# EAGLE design ECG (EAGLE 7.2.0)
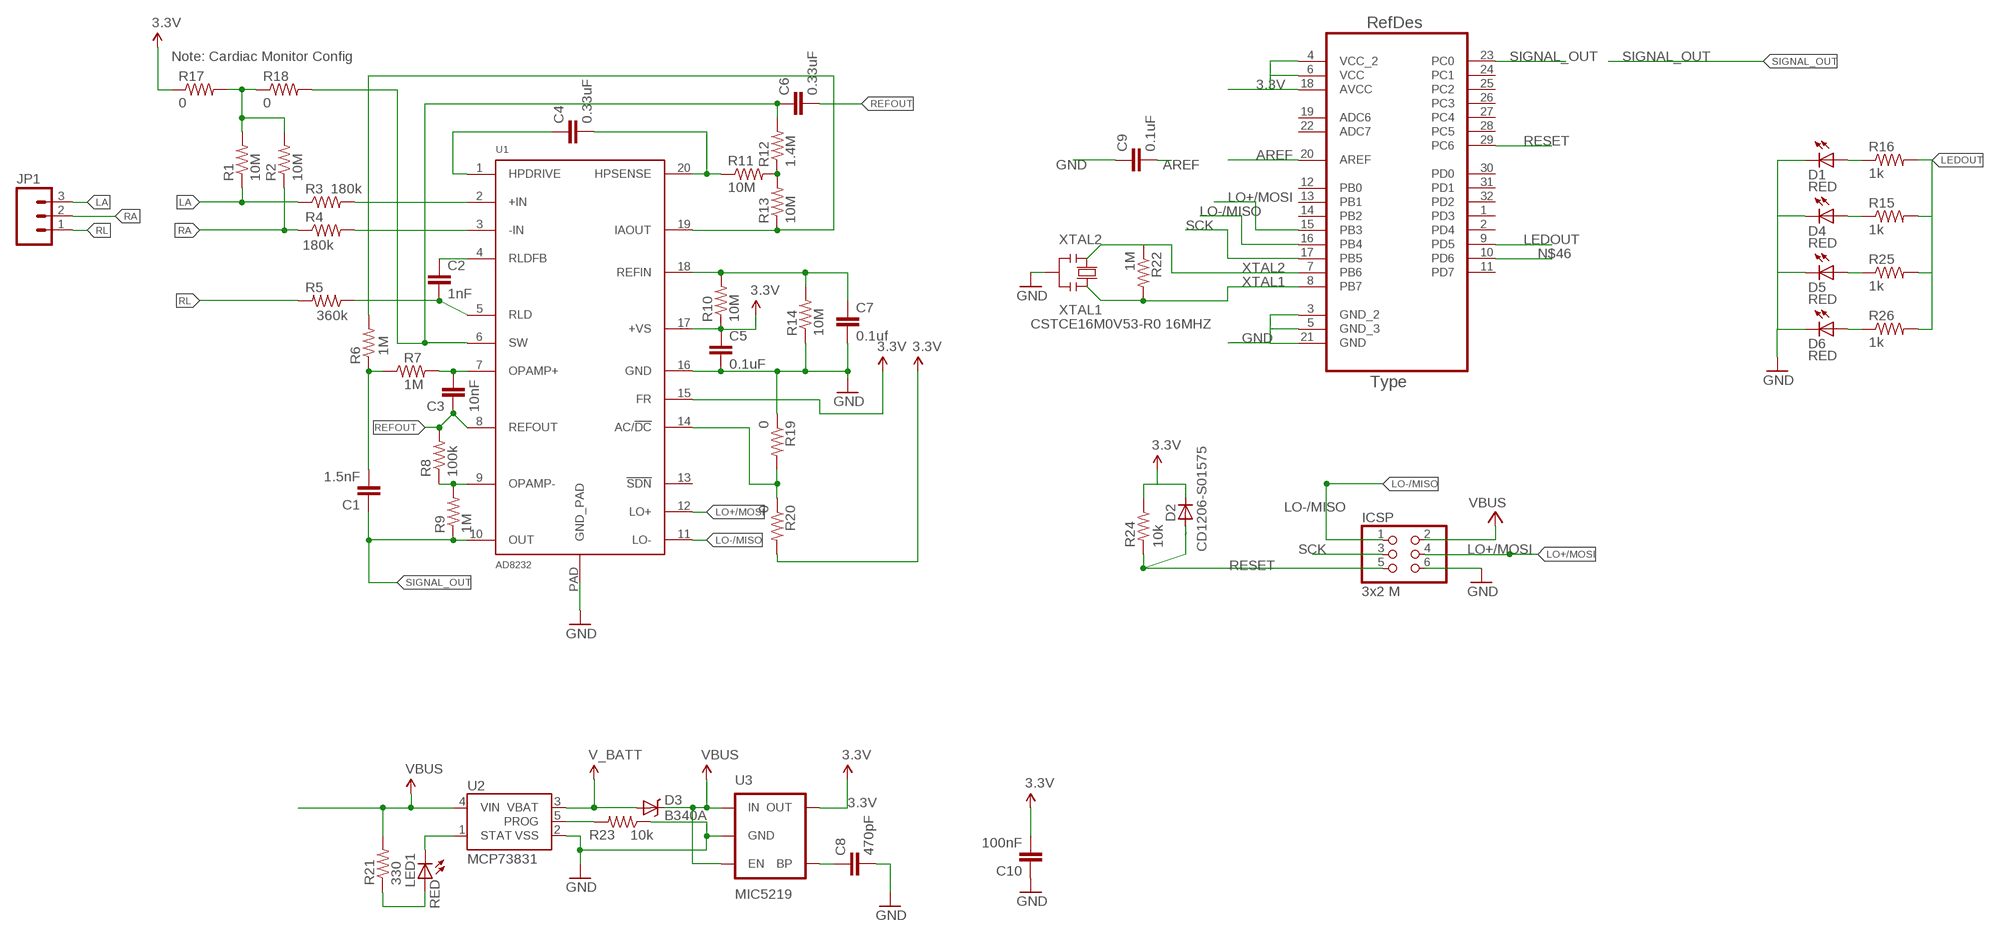
[diagram p0: schematic, sheet 1]

## Parts
C1  1.5nF  CAP0402-CAP  [0402-CAP]
C2  1nF  CAP0402-CAP  [0402-CAP]
C3  10nF  CAP0402-CAP  [0402-CAP]
C4  0.33uF  CAP0805  [0805]
C5  0.1uF  CAP0402-CAP  [0402-CAP]
C6  0.33uF  CAP0805  [0805]
C7  0.1uf  CAP0402-CAP  [0402-CAP]
C8  470pF  CAP0603-CAP  [0603-CAP]
C9  0.1uF  CAP0402-CAP  [0402-CAP]
C10  100nF  CAP0402-CAP  [0402-CAP]
D1  RED  LED-RED0603  [LED-0603@1]
D2  CD1206-S01575  DIODE-MINIMELF  [MINIMELF]
D3  B340A  DIODE-SCHOTTKY-B340A  [SMA-DIODE]
D4  RED  LED-RED0603  [LED-0603@1]
D5  RED  LED-RED0603  [LED-0603@1]
D6  RED  LED-RED0603  [LED-0603@1]
ICSP  3x2 M  PINHD-2X3  [2X03]
JP1  M03PTH  [1X03]
LED1  RED  LED0603  [LED-0603]
R1  10M  RESISTOR0402-RES  [0402-RES]
R2  10M  RESISTOR0402-RES  [0402-RES]
R3  180k  RESISTOR0402-RES  [0402-RES]
R4  180k  RESISTOR0402-RES  [0402-RES]
R5  360k  RESISTOR0402-RES  [0402-RES]
R6  1M  RESISTOR0402-RES  [0402-RES]
R7  1M  RESISTOR0402-RES  [0402-RES]
R8  100k  RESISTOR0402-RES  [0402-RES]
R9  1M  RESISTOR0402-RES  [0402-RES]
R10  10M  RESISTOR0402-RES  [0402-RES]
R11  10M  RESISTOR0402-RES  [0402-RES]
R12  1.4M  RESISTOR0402-RES  [0402-RES]
R13  10M  RESISTOR0402-RES  [0402-RES]
R14  10M  RESISTOR0402-RES  [0402-RES]
R15  1k  1K-1%  [0603-RES@1]
R16  1k  1K-1%  [0603-RES@1]
R17  0  0OHM1/10W5%(0603)  [0603]
R18  0  0OHM1/10W5%(0603)  [0603]
R19  0  0OHM1/10W5%(0603)  [0603]
R20  0  0OHM1/10W5%(0603)  [0603]
R21  330  RESISTOR0603-RES  [0603-RES]
R22  1M  RESISTOR0402-RES  [0402-RES]
R23  10k  RESISTOR0603-RES  [0603-RES]
R24  10k  RESISTOR0402-RES  [0402-RES]
R25  1k  1K-1%  [0603-RES@1]
R26  1k  1K-1%  [0603-RES@1]
U1  AD8232  [LFCSP_20]
U2  MCP73831  [SOT23-5]
U3  MIC5219  V_REG_MIC52193.3V  [SOT23-5]
U4  ATMEGA328P-AU  [QFP80P900X900X120-32N]
Y2  CSTCE16M0V53-R0 16MHZ  RESONATORMU  [RESONATOR]

## Nets
3.3V: C5.1 C10.2 D2.C R10.1 R17.1 R20.2 R24.1 U1.15(FR) U1.17(+VS) U3.5(OUT) U4.4(VCC_2) U4.6(VCC) U4.18(AVCC)
AREF: C9.2 U4.20(AREF)
GND: C5.2 C7.2 C8.2 C9.1 C10.1 D1.C D4.C D5.C D6.C ICSP.6 R14.1 R19.1 R23.1 U1.16(GND) U1.PAD(GND_PAD) U2.2(VSS) U3.2(GND) U4.3(GND_2) U4.5(GND_3) U4.21(GND) Y2.2
LA: JP1.3 R1.1 R3.1
LEDOUT: R15.2 R16.2 R25.2 R26.2 U4.9(PD5)
LO+/MOSI: ICSP.4 U1.12(LO+) U4.15(PB3)
LO-/MISO: ICSP.1 U1.11(LO-) U4.16(PB4)
N$1: R3.2 U1.2(+IN)
N$2: R4.2 U1.3(-IN)
N$3: C3.2 R7.2 U1.7(OPAMP+)
N$4: C4.2 R11.1 U1.20(HPSENSE)
N$5: C7.1 R10.2 R14.2 U1.18(REFIN)
N$6: D1.A R16.1
N$7: R8.1 R9.2 U1.9(OPAMP-)
N$8: R6.2 R13.1 U1.19(IAOUT)
N$9: C1.2 R6.1 R7.1
N$11: R19.2 R20.1 U1.14(AC/!DC)
N$13: C4.1 U1.1(HPDRIVE)
N$14: R11.2 R12.1 R13.2
N$15: LED1.A R21.1
N$16: C6.1 R12.2 R18.2 U1.6(SW)
N$17: C2.1 U1.4(RLDFB)
N$18: C2.2 R5.1 U1.5(RLD)
N$19: LED1.C U2.1(STAT)
N$20: R1.2 R2.2 R17.2 R18.1
N$21: R23.2 U2.5(PROG)
N$22: C8.1 U3.4(BP)
N$39: D6.A R26.1
N$40: D5.A R25.1
N$41: D4.A R15.1
N$46: U4.10(PD6)
RA: JP1.2 R2.1 R4.1
REFOUT: C3.1 C6.2 R8.2 U1.8(REFOUT)
RESET: D2.A ICSP.5 R24.2 U4.29(PC6)
RL: JP1.1 R5.2
SCK: ICSP.3 U4.17(PB5)
SIGNAL_OUT: C1.1 R9.1 U1.10(OUT) U4.23(PC0)
V_BATT: D3.A U2.3(VBAT)
VBUS [usbvcc]: D3.C ICSP.2 R21.2 U2.4(VIN) U3.1(IN) U3.3(EN)
XTAL1: R22.2 U4.8(PB7) Y2.3
XTAL2: R22.1 U4.7(PB6) Y2.1
Unconnected: U1.13(!SDN) U4.1(PD3) U4.2(PD4) U4.11(PD7) U4.12(PB0) U4.13(PB1) U4.14(PB2) U4.19(ADC6) U4.22(ADC7) U4.24(PC1) U4.25(PC2) U4.26(PC3) U4.27(PC4) U4.28(PC5) U4.30(PD0) U4.31(PD1) U4.32(PD2)

## Notes on the sheet
- Note: Cardiac Monitor Config

## Library data of the parts
C1-C7 C9 C10 = SparkFun-Passives:CAP: Capacitor Standard 0603 ceramic capacitor, and 0.1" leaded capacitor.
C8 = SparkFun-Passives:CAP: Capacitor Standard 0603 ceramic capacitor, and 0.1" leaded capacitor.; PROD_ID: CAP-07884
D1 D4-D6 = SparkFun-LED:LED-RED: Assorted Red LEDs LilyPad 1206- DIO-09912 1206- DIO-00809 0603- DIO-00819; PROD_ID: DIO-00819
D2 = diode:DIODE-: DIODE
D3 = SparkFun-DiscreteSemi:DIODE-SCHOTTKY: Schottky diodes in SFE's production catalog BAT20J 1A 23V 0.62Vf RB751 120mA 40V 0.37Vf PMEG4005EJ 0.5A 40V 0.42Vf MBRA140 1A 40V 0.5Vf B340A 3A 40V SMA; PROD_ID: DIO-09886
ICSP = SmartPrj:PINHD-2X3: PIN HEADER
JP1 = SparkFun-Connectors:M03: Header 3 Standard 3-pin 0.1" header. Use with straight break away headers (SKU : PRT-00116), right angle break away headers (PRT-00553), swiss pins (PRT-00743), machine pins (PRT-00117), and female headers (PRT-00115). Molex polarized connector foot print use with SKU : PRT-08232 with associated crimp pins and housings.
LED1 = SparkFun-LED:LED: LEDs Standard schematic elements and footprints for 5mm, 3mm, 1206, and 0603 sized LEDs. 5mm - Spark Fun Electronics SKU : COM-00529 (and others); PROD_ID: DIO-00819
R1-R14 R22 R24 = SparkFun-Passives:RESISTOR: Resistor Basic schematic elements and footprints for 0603, 1206, and PTH resistors.
R15 R16 R25 R26 = SparkFun-Resistors:1K-1%: 1k-ohm SMT 1/10W - 1% (0603) RES-07856; PROD_ID: RES-07856
R17-R20 = SparkFun-Resistors:0OHM1/10W5%(0603): RES-08609; PROD_ID: RES-08609
R21 = SparkFun-Passives:RESISTOR: Resistor Basic schematic elements and footprints for 0603, 1206, and PTH resistors.; PROD_ID: RES-00818
R23 = SparkFun-Resistors:RESISTOR: Resistor Basic schematic elements and footprints for 0603, 1206, and PTH resistors.; PROD_ID: RES-00824
U1 = AD8232:AD8232
U2 = SparkFun-PowerIC:MCP73831: Miniature single cell, fully integrated Li-Ion, Li-polymer charge management controller http://ww1.microchip.com/downloads/en/DeviceDoc/21984a.pdf IC-09995; PROD_ID: IC-09995
U3 = SparkFun-PowerIC:V_REG_MIC5219: V_REG MIC5219 Standard 3.3V and 5V 500mA LDO voltage regulator in SOT-23 layout. Micrel part MIC5219. BP (by-pass) pin is used to lower output noise with 470pF cap, may be left open.; PROD_ID: VREG-09872; VALUE: MIC5219 3.3V
U4 = atmega328tqfp:ATMEGA328P-AU; DESCRIPTION: 8-bit Microcontroller with In-System Programmable Flash; MPN: ATMEGA328P-AU; OC_FARNELL: 1715486; OC_NEWARK: 14R4631; PACKAGE: TQFP-32; SUPPLIER: Atmel
Y2 = SmartPrj:RESONATOR

## Net classes
0 default: clearance 0.205 mm
2 gnd: width 0.305 mm, drill 0.559 mm, clearance 0.254 mm
3 usbvcc: width 0.508 mm, drill 0.61 mm, clearance 0.205 mm to class 0, clearance 0.205 mm to class 1, clearance 0.205 mm to class 2, clearance 0.254 mm
4 aref: width 0.406 mm, drill 0.61 mm, clearance 0.254 mm

## Board
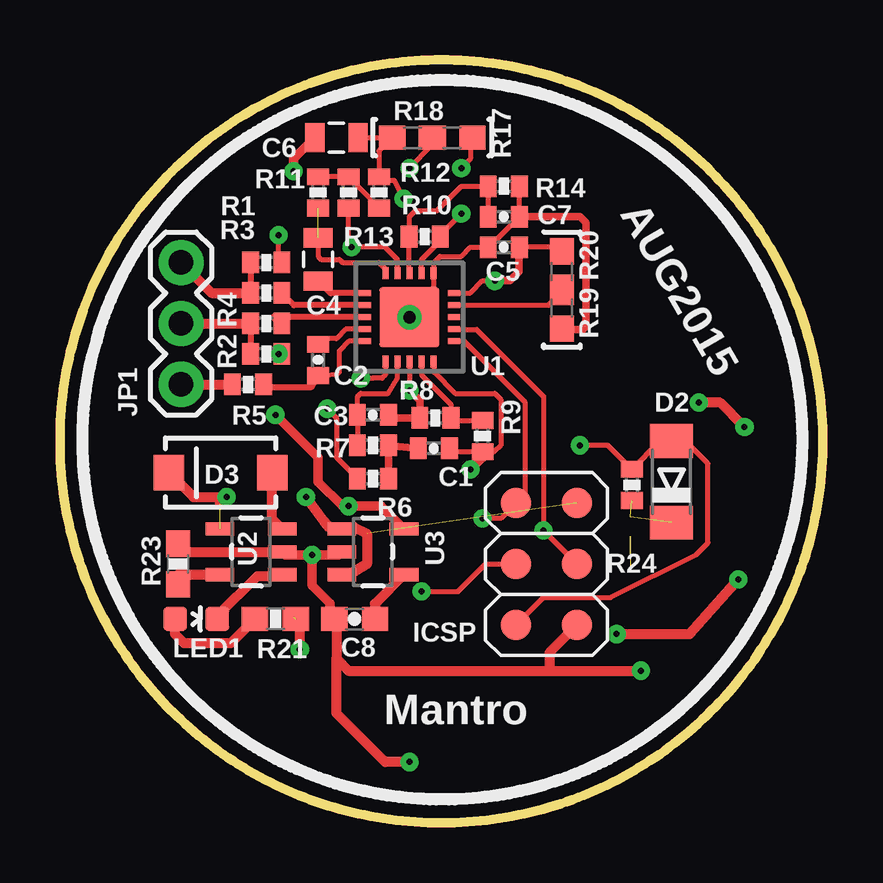
[diagram p1: board, top side]
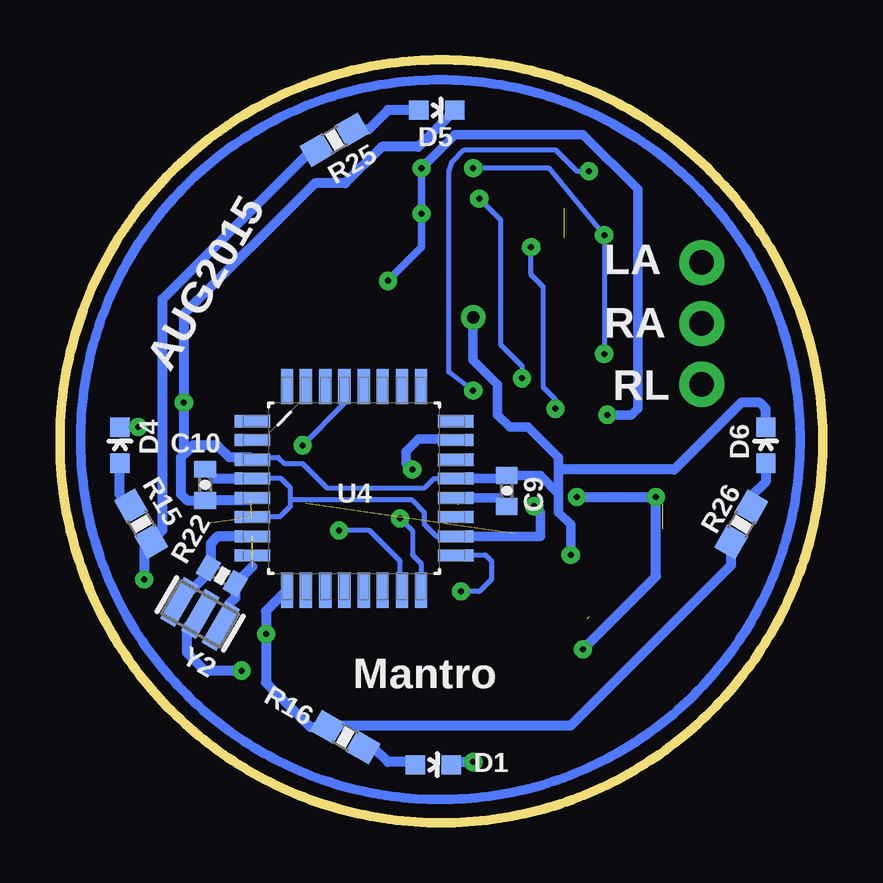
[diagram p2: board, bottom side, seen from below]

Size 31.8 x 31.8 mm. Coordinates in mm from the lower left corner, seen from the top.
Outline: 31.8,15.63 31.79,15.35 31.78,15.08 31.77,14.81 31.75,14.54 31.72,14.27 31.69,14.01 31.66,13.74 31.62,13.48 31.58,13.22 31.53,12.95 31.48,12.7 31.42,12.44 31.37,12.18 31.3,11.93 31.23,11.67 31.16,11.42 31.09,11.17 31.01,10.92 30.92,10.68 30.84,10.43 30.75,10.19 30.65,9.95 30.55,9.71 30.45,9.47 30.34,9.24 30.23,9.01 30.12,8.78 30,8.55 29.88,8.32 29.76,8.1 29.63,7.87 29.5,7.66 29.37,7.44 29.23,7.22 29.09,7.01 28.94,6.8 28.79,6.59 28.64,6.39 28.49,6.18 28.33,5.98 28.17,5.79 28.01,5.59 27.84,5.4 27.67,5.21 27.5,5.02 27.32,4.84 27.14,4.66 26.96,4.48 26.78,4.3 26.59,4.13 26.4,3.96 26.21,3.79 26.01,3.63 25.82,3.47 25.62,3.31 25.41,3.16 25.21,3.01 25,2.86 24.79,2.72 24.58,2.57 24.36,2.43 24.14,2.3 23.93,2.17 23.7,2.04 23.25,1.8 23.03,1.68 22.79,1.57 22.56,1.46 22.33,1.35 21.85,1.15 21.61,1.05 21.37,0.96 21.12,0.88 20.88,0.79 20.38,0.64 20.13,0.57 19.87,0.5 19.62,0.44 19.36,0.38 19.1,0.32 18.85,0.27 18.58,0.22 18.32,0.18 18.06,0.14 17.79,0.11 17.53,0.08 17.26,0.05 16.99,0.03 16.72,0.02 16.45,0.01 16.17,0 15.63,0 15.35,0.01 15.08,0.02 14.81,0.03 14.54,0.05 14.27,0.08 14.01,0.11 13.74,0.14 13.48,0.18 13.22,0.22 12.95,0.27 12.7,0.32 12.44,0.38 12.18,0.44 11.93,0.5 11.67,0.57 11.42,0.64 11.17,0.71 10.92,0.79 10.68,0.88 10.43,0.96 10.19,1.05 9.95,1.15 9.47,1.35 9.24,1.46 9.01,1.57 8.78,1.68 8.55,1.8 8.1,2.04 7.87,2.17 7.66,2.3 7.44,2.43 7.22,2.57 7.01,2.72 6.8,2.86 6.59,3.01 6.39,3.16 6.18,3.31 5.98,3.47 5.79,3.63 5.59,3.79 5.4,3.96 5.21,4.13 5.02,4.3 4.84,4.48 4.48,4.84 4.3,5.02 4.13,5.21 3.96,5.4 3.79,5.59 3.63,5.79 3.47,5.98 3.31,6.18 3.16,6.39 3.01,6.59 2.86,6.8 2.72,7.01 2.57,7.22 2.44,7.44 2.3,7.66 2.17,7.87 2.04,8.1 1.92,8.32 1.8,8.55 1.68,8.78 1.57,9.01 1.46,9.24 1.35,9.47 1.15,9.95 1.05,10.19 0.97,10.43 0.88,10.68 0.79,10.92 0.72,11.17 0.64,11.42 0.57,11.67 0.5,11.93 0.44,12.18 0.38,12.44 0.32,12.7 0.27,12.95 0.22,13.22 0.18,13.48 0.14,13.74 0.11,14.01 0.08,14.27 0.06,14.54 0.03,14.81 0.02,15.08 0.01,15.35 0,15.63 0,16.17 0.01,16.45 0.02,16.72 0.03,16.99 0.06,17.26 0.08,17.53 0.11,17.79 0.14,18.06 0.18,18.32 0.22,18.58 0.27,18.85 0.32,19.1 0.38,19.36 0.44,19.62 0.5,19.87 0.57,20.13 0.64,20.38 0.72,20.63 0.79,20.88 0.88,21.12 0.97,21.37 1.05,21.61 1.15,21.85 1.35,22.33 1.46,22.56 1.57,22.79 1.68,23.03 1.8,23.25 1.92,23.48 2.04,23.7 2.17,23.93 2.3,24.14 2.44,24.36 2.57,24.58 2.72,24.79 2.86,25 3.01,25.21 3.16,25.41 3.31,25.62 3.47,25.82 3.63,26.01 3.79,26.21 3.96,26.4 4.13,26.59 4.3,26.78 4.48,26.96 4.66,27.14 4.84,27.32 5.02,27.5 5.21,27.67 5.4,27.84 5.59,28.01 5.79,28.17 5.98,28.33 6.18,28.49 6.39,28.64 6.59,28.79 6.8,28.94 7.01,29.08 7.22,29.23 7.44,29.37 7.66,29.5 7.87,29.63 8.1,29.76 8.32,29.88 8.55,30 8.78,30.12 9.01,30.23 9.24,30.34 9.47,30.45 9.95,30.65 10.19,30.75 10.43,30.84 10.68,30.92 10.92,31.01 11.17,31.09 11.42,31.16 11.67,31.23 11.93,31.3 12.18,31.36 12.44,31.42 12.7,31.48 12.95,31.53 13.22,31.58 13.48,31.62 13.74,31.66 14.01,31.69 14.27,31.72 14.54,31.75 14.81,31.77 15.08,31.78 15.35,31.79 15.63,31.8 16.17,31.8 16.45,31.79 16.72,31.78 16.99,31.77 17.26,31.75 17.53,31.72 17.79,31.69 18.06,31.66 18.32,31.62 18.58,31.58 18.85,31.53 19.1,31.48 19.36,31.42 19.62,31.36 19.87,31.3 20.13,31.23 20.38,31.16 20.63,31.09 20.88,31.01 21.12,30.92 21.37,30.84 21.61,30.75 21.85,30.65 22.33,30.45 22.56,30.34 22.79,30.23 23.03,30.12 23.25,30 23.48,29.88 23.7,29.76 23.93,29.63 24.14,29.5 24.36,29.37 24.58,29.23 24.79,29.08 25,28.94 25.21,28.79 25.41,28.64 25.62,28.49 25.82,28.33 26.01,28.17 26.21,28.01 26.4,27.84 26.59,27.67 26.78,27.5 26.96,27.32 27.14,27.14 27.32,26.96 27.5,26.78 27.67,26.59 27.84,26.4 28.01,26.21 28.17,26.01 28.33,25.82 28.49,25.62 28.64,25.41 28.79,25.21 28.94,25 29.09,24.79 29.23,24.58 29.37,24.36 29.5,24.14 29.63,23.93 29.76,23.7 29.88,23.48 30,23.25 30.12,23.03 30.23,22.79 30.34,22.56 30.45,22.33 30.55,22.09 30.65,21.85 30.75,21.61 30.84,21.37 30.92,21.12 31.01,20.88 31.09,20.63 31.16,20.38 31.23,20.13 31.3,19.87 31.37,19.62 31.42,19.36 31.48,19.1 31.53,18.85 31.58,18.58 31.62,18.32 31.66,18.06 31.69,17.79 31.72,17.53 31.75,17.26 31.77,16.99 31.78,16.72 31.79,16.45 31.8,16.17 31.8,15.63
Copper layers (1*16): Top 0.035mm / dielectric 0.8mm / Bottom 0.035mm
Design rules "integrated": minimum track width 10mil, minimum drill 10mil, track to track 0.205mm, track to pad 0.205mm, pad to pad 0.205mm, via to via 0.205mm, smd to smd 8mil, copper to edge 8mil, drill to drill 8mil, minimum pad ring 10mil, minimum via ring 10mil, stop-mask expansion 4mil, vias tented up to drill 20mil, thermal gap 15mil

### Footprints (pad centres in the part's own frame; a part is rotated, then mirrored left to right if it is on the bottom)
0402-CAP = smd 0.7 x 0.9: 1 -0.65,0; 2 0.65,0
0805 = smd 0.8 x 1.2: 1 -0.9,0; 2 0.9,0
0603-CAP = smd 1.1 x 1: 1 -0.85,0; 2 0.85,0
LED-0603@1 = smd 0.8 x 0.8: A 0,-0.75; C 0,0.75
MINIMELF = smd 1.4 x 1.8: A 1.7,0; C -1.7,0
SMA-DIODE = smd 1.27 x 1.47: A -2.15,0; C 2.15,0
2X03 = smd 1.27 x 1.27: 1 -2.54,-1.27; 2 -2.54,1.27; 3 0,-1.27; 4 0,1.27; 5 2.54,-1.27; 6 2.54,1.27
1X03 = drill 1.016 pad 1.88: 1 0,0; 2 2.54,0; 3 5.08,0
LED-0603 = smd 1 x 1: A 0,-0.877; C 0,0.877
0402-RES = smd 0.7 x 0.9: 1 -0.65,0; 2 0.65,0
0603-RES@1 = smd 1.1 x 1: 1 -0.85,0; 2 0.85,0
0603 = smd 1.1 x 1: 1 -0.85,0; 2 0.85,0
0603-RES = smd 1.1 x 1: 1 -0.85,0; 2 0.85,0
LFCSP_20 = smd 0.5 x 0.25: 1 -1.85,1; 2 -1.85,0.5; 3 -1.85,0; 4 -1.85,-0.5; 5 -1.85,-1; 11 1.85,-1; 12 1.85,-0.5; 13 1.85,0; 14 1.85,0.5; 15 1.85,1 | smd 0.25 x 0.5: 6 -1,-1.85; 7 -0.5,-1.85; 8 0,-1.85; 9 0.5,-1.85; 10 1,-1.85; 16 1,1.85; 17 0.5,1.85; 18 0,1.85; 19 -0.5,1.85; 20 -1,1.85 | smd 2.5 x 2.5: PAD 0,0
SOT23-5 = smd 0.55 x 1.2: 1 -0.95,-1.3; 2 0,-1.3; 3 0.95,-1.3; 4 0.95,1.3; 5 -0.95,1.3
QFP80P900X900X120-32N = smd 1.473 x 0.508: 1 -4.242,2.794; 2 -4.242,2.007; 3 -4.242,1.194; 4 -4.242,0.406; 5 -4.242,-0.406; 6 -4.242,-1.194; 7 -4.242,-2.007; 8 -4.242,-2.794; 17 4.242,-2.794; 18 4.242,-2.007; 19 4.242,-1.194; 20 4.242,-0.406; 21 4.242,0.406; 22 4.242,1.194; 23 4.242,2.007; 24 4.242,2.794 | smd 0.508 x 1.473: 9 -2.794,-4.242; 10 -2.007,-4.242; 11 -1.194,-4.242; 12 -0.406,-4.242; 13 0.406,-4.242; 14 1.194,-4.242; 15 2.007,-4.242; 16 2.794,-4.242; 25 2.794,4.242; 26 2.007,4.242; 27 1.194,4.242; 28 0.406,4.242; 29 -0.406,4.242; 30 -1.194,4.242; 31 -2.007,4.242; 32 -2.794,4.242
RESONATOR = smd 0.7 x 2: 1 -1,0; 2 0,0; 3 1,0

### Placement (x,y rotation side)
C1  15.59,15.61 180 top
C2  10.76,19.29 270 top
C3  13.05,17.01 180 top
C4  10.76,23.48 90 top
C5  18.51,23.99 180 top
C6  11.52,28.56 180 top
C7  18.51,25.26 0 top
C8  12.29,8.5 180 top
C9  13.17,13.83 270 bottom
C10  25.75,14.09 90 bottom
D1  16.24,2.42 270 bottom
D2  25.49,14.21 90 top
D3  6.7,14.59 180 top
D4  29.3,15.74 0 bottom
D5  16.1,29.71 270 bottom
D6  2.38,15.74 0 bottom
DRILEGEND  [DRILEGEND]  0.69,-144.01 0 top  (outside the outline)
ICSP  20.29,10.78 270 top
JP1  5.05,18.28 90 top
LED1  5.68,8.5 270 top
R1  8.6,23.36 0 top
R2  8.6,19.55 0 top
R3  8.6,22.09 0 top
R4  8.6,20.82 0 top
R5  7.84,18.28 180 top
R6  13.05,14.34 180 top
R7  13.05,15.74 180 top
R8  15.65,16.88 180 top
R9  17.62,16.12 90 top
R10  15.21,24.44 180 top
R11  10.76,26.28 90 top
R12  13.3,26.28 90 top
R13  12.03,26.28 90 top
R14  18.51,26.53 180 top
R15  28.41,12.47 300 bottom
R16  19.91,3.57 150 bottom
R17  16.35,28.56 180 top
R18  14.7,28.56 180 top
R19  20.92,21.45 90 top
R20  20.92,22.98 90 top
R21  8.98,8.5 0 top
R22  25.05,10.29 150 bottom
R23  4.92,10.78 270 top
R24  23.84,14.09 90 top
R25  20.35,28.47 210 bottom
R26  3.4,12.44 240 bottom
U1  14.57,21.07 0 top
U2  7.97,11.29 90 top
U3  13.05,11.29 270 top
U4  19.54,13.94 0 bottom
Y2  25.95,8.71 150 bottom

### Tracks (layer width: path | path; a pad name or v marks a point on that pad's centre or on a via)
3.3V  (via drill 0.25)  (2 unrouted)
  Top 0.2: v16.73,25.39 15.98,24.64 R10.1 15.86,24.26 15.08,23.48 U1.17 | R20.2 20.76,23.99 C5.1 | U1.15 16.44,22.09 17.11,22.09 17.62,22.6 v18.13,22.6 | R17.1 17.11,28.48 17.11,27.68 v16.73,27.29
  Top 0.305: C5.1 19.14,23.98 19.14,22.98 18.76,22.6 v18.13,22.6
  Top 0.4: U3.5 13.39,13.2 v12.03,13.2 11.78,13.2 10.76,14.21 10.76,15.23 v8.98,17.01
  Bottom 0.2: 23.66,14.47 U4.4 22.58,14.35 22.19,13.96 22.19,13.45 | U4.6 22.64,12.75 22.19,13.2 22.19,13.45 | U4.18 15.31,11.93 16.1,11.93 16.6,12.44 16.6,12.94 17.11,13.45 22.19,13.45
  Bottom 0.305: v16.73,27.29 v16.73,25.39 16.73,23.99 v18.13,22.6
  Bottom 0.4: v12.03,13.2 11.78,12.94 11.78,11.93 11.79,11.94 U4.18 | v16.73,27.29 15.33,28.69 10,28.69 7.71,26.41 7.71,17.26 7.97,17.01 v8.98,17.01
  Bottom 0.406: C10.2 25.36,14.35 U4.4
AREF
  Bottom 0.4: 15.21,13.45 U4.20 13.53,13.54 C9.2
GND  (via drill 0.25, 0.51)
  Top 0.2: R14.1 C7.2 17.89,23.99 C5.2 17.11,23.99 16.73,23.61 15.84,23.61 15.59,23.36 15.59,22.94 U1.16
  Top 0.203: 15.07,21.57 U1.PAD 15.57,22.33 U1.16
  Top 0.305: R19.1 20.96,20.56 21.81,20.56 21.94,20.69 21.94,25.01 21.68,25.26 C7.2
  Top 0.4: C8.2 11.27,8.66 11.27,9.13 10.51,9.9 v10.51,11.17 | U2.2 9.39,11.17 v10.51,11.17 | U3.2 11.62,11.17 v10.51,11.17
  Top 0.406: R23.1 5.26,11.29 U2.2 | C8.2 11.52,8.41 11.52,6.85 | 11.52,6.85 12.03,6.34 20.41,6.34 | 20.41,6.34 v24.22,6.34 | ICSP.6 20.41,7.1 20.41,6.34 | v14.57,2.53 13.56,2.53 11.52,4.56 11.52,6.85 | v28.54,16.5 27.53,17.52 v26.64,17.52
  Bottom 0.2: U4.5 23.87,13.45 | 23.87,15.23 22.7,15.23 22.45,14.98 21.68,14.98 20.67,13.96 16.6,13.96 16.21,14.35 U4.21
  Bottom 0.4: U4.21 13.31,14.35 C9.1 13.16,14.47 11.78,14.47 11.02,13.71 | v10.51,11.17 10.51,12.44 11.02,12.94 11.02,13.71 | 11.02,13.71 11.02,14.72 11.02,15.23 12.29,16.5 13.05,16.5 13.56,17.01 13.56,18.28 14.57,19.29 U1.PAD
  Bottom 0.406: 23.87,13.45 23.88,13.44 C10.1 26.49,13.44 26.76,13.71 26.76,15.23 26.64,15.36 | U4.3 23.87,15.23 24.73,15.23 25.24,15.74 26.26,15.74 26.64,15.36 | v24.22,6.34 25.75,6.34 26.51,7.1 26.51,8.15 Y2.2 | D1.C 15.38,2.53 v14.57,2.53 | D6.C 2.38,17.26 2.63,17.52 3.4,17.52 6.19,14.72 11.02,14.72 | D5.C 15.59,29.47 16.1,28.95 16.86,28.18 18.38,28.18 19.91,26.66 21.18,26.66 26.64,21.2 v26.64,17.52 26.64,15.36 | D4.C v28.54,16.5
  other vias: 14.57,21.07
LA
  Top 0.254: R1.1 R3.1
  Top 0.406: JP1.3 6.32,22.09 R3.1
LEDOUT  (via drill 0.25)
  Top 0.406: v23.21,7.86 26.26,7.86 v28.29,10.15
  Bottom 0.406: U4.9 23.21,8.83 v23.21,7.86 23.21,5.83 21.37,3.99 R16.2 20.58,4.05 10.51,4.05 3.82,10.74 R26.2 | R25.2 21.31,28.05 27.53,21.83 27.53,12.2 R15.2 28.29,11.44 v28.29,10.15
LO+/MOSI  (via drill 0.25)
  Top 0.2: ICSP.4 v20.16,12.18 20.16,17.77 17.37,20.56 U1.12
  Bottom 0.2: U4.15 17.62,9.79 17.62,10.91 18.89,12.18 v20.16,12.18
LO-/MISO  (via drill 0.25)
  Top 0.2: 18,18.91 19.4,17.52 19.4,13.71 ICSP.1 18.38,12.69 v17.62,12.69
  Top 0.203: U1.11 16.84,20.07 18,18.91
  Bottom 0.2: v17.62,12.69 17.11,12.18 17.11,11.17 16.75,10.8 U4.16
N$1
  Top 0.254: U1.2 9.75,21.57 9.24,22.09 R3.2
N$2
  Top 0.254: U1.3 8.86,21.07 R4.2
N$3
  Top 0.2: U1.7 14.07,18.54 13.68,17.9 12.54,17.9 12.41,17.77 12.41,17.02 C3.2 R7.2
N$4  (1 unrouted)
  Top 0.2: C4.2 10.76,23.61 10.89,23.48 11.65,23.48 11.78,23.36 13.3,23.36 13.56,23.1 13.56,22.94 U1.20
N$5
  Top 0.2: C7.1 R14.2 16.73,26.53 15.71,25.52 14.83,25.52 14.57,25.26 14.57,24.5 14.44,24.37 14.49,24.37 R10.2 | R10.2 14.57,24.45 | U1.18 14.56,22.94 R10.2
N$6
  Bottom 0.406: D1.A 17.1,2.53 18.13,2.53 18.74,3.14 R16.1
N$7
  Top 0.2: U1.9 15.08,18.66 16.3,17.44 R8.1 16.44,16.77 R9.2
N$8  (via drill 0.25)
  Top 0.2: R13.1 12.03,24.12 v12.16,23.99 13.56,23.99 14.06,23.48 U1.19 | v11.14,17.26 11.52,16.88 11.52,15.23 12.4,14.36 R6.2
  Bottom 0.2: v11.14,17.26 11.14,17.64 11.65,18.15 11.65,22.34 12.16,22.85 v12.16,23.99
N$9
  Top 0.305: R6.1 R7.1 C1.2 15.06,15.61
N$11
  Top 0.203: U1.14 17.37,21.57 19.14,21.58 20.37,21.58 R20.1 R19.2
N$12  (via drill 0.25)
  other vias: 10,7.23
N$13
  Top 0.254: U1.1 11.29,22.07 C4.1
N$14
  Top 0.2: R12.1 R13.2 R11.2
N$15
  Top 0.406: R21.1 7.12,7.48 5.17,7.48 4.8,7.85 LED1.A
N$16  (via drill 0.25)
  Top 0.2: C6.1 R18.2 13.3,28.02 R12.2 13.3,26.79 13.94,26.79 v14.32,26.02 | v12.54,18.53 13.04,18.53
  Top 0.203: U1.6 13.57,18.67 13.43,18.53 13.04,18.53
  Bottom 0.2: v14.32,26.02 13.43,25.14 13.43,19.93 12.54,19.04 v12.54,18.53
N$17
  Top 0.203: U1.4 11.91,20.57 11.52,20.18 10.76,20.18 C2.1
N$18
  Top 0.203: C2.2 11.56,18.7 11.65,18.79 11.65,19.67 12.05,20.07 U1.5 | R5.1 8.6,18.15
  Top 0.254: C2.2 10.47,18.15 8.6,18.15
N$19
  Top 0.406: U2.1 9.27,10.28 8.22,10.28 6.56,8.61 LED1.C
N$20  (via drill 0.25)
  Top 0.2: R2.2 8.74,19.8 v9.11,19.55 | R1.2 9.11,23.47 v9.11,24.5 | v14.57,27.29 15.5,28.22 R17.2
  Top 0.203: R17.2 R18.1
  Bottom 0.2: v9.11,19.55 v9.11,24.5 11.4,27.29 v14.57,27.29
N$21
  Top 0.406: R23.2 4.92,10.34 U2.5
N$22
  Top 0.406: U3.4 13.14,9.13 C8.1
N$33  (via drill 0.25)
  other vias: 14.57,27.29
N$39
  Bottom 0.406: D6.A 2.38,14.21 2.97,13.62 R26.1
N$40
  Bottom 0.406: D5.A 18.13,29.71 18.94,28.9 R25.1
N$41
  Bottom 0.406: R15.1 29.3,13.67 D4.A
N$42
  Top 0.4: 30.94,15.71 30.93,15.45 30.92,15.2 30.91,14.94 30.89,14.69 30.84,14.18 30.81,13.93 30.77,13.69 30.73,13.44 30.69,13.19 30.64,12.95 30.59,12.7 30.53,12.46 30.47,12.22 30.41,11.98 30.34,11.74 30.27,11.51 30.19,11.27 30.11,11.04 30.03,10.81 29.95,10.58 29.86,10.36 29.76,10.13 29.67,9.91 29.57,9.68 29.46,9.47 29.36,9.25 29.25,9.03 29.13,8.82 29.01,8.61 28.89,8.4 28.77,8.19 28.64,7.99 28.51,7.78 28.38,7.58 28.24,7.38 28.1,7.19 27.96,6.99 27.82,6.8 27.67,6.61 27.51,6.43 27.36,6.24 27.2,6.06 27.04,5.88 26.88,5.71 26.72,5.53 26.55,5.36 26.38,5.19 26.2,5.03 26.03,4.87 25.85,4.7 25.67,4.55 25.3,4.24 25.11,4.09 24.92,3.95 24.72,3.81 24.53,3.67 24.13,3.4 23.92,3.27 23.72,3.14 23.51,3.02 23.3,2.9 23.09,2.78 22.88,2.66 22.66,2.55 22.44,2.45 22.23,2.34 22,2.24 21.78,2.15 21.55,2.05 21.33,1.96 21.1,1.88 20.87,1.8 20.64,1.72 20.17,1.57 19.93,1.5 19.69,1.44 19.45,1.38 19.21,1.32 18.96,1.27 18.72,1.22 18.47,1.18 18.22,1.14 17.98,1.1 17.73,1.07 17.47,1.05 17.22,1.02 16.97,1 16.46,0.98 16.2,0.97 15.68,0.97 15.42,0.98 15.17,0.99 14.91,1 14.66,1.02 14.41,1.05 14.15,1.07 13.9,1.1 13.66,1.14 13.41,1.18 13.16,1.22 12.92,1.27 12.67,1.32 12.43,1.38 12.19,1.44 11.95,1.5 11.71,1.57 11.48,1.64 11.24,1.72 11.01,1.8 10.78,1.88 10.55,1.96 10.33,2.05 9.88,2.24 9.66,2.34 9.44,2.45 9.22,2.55 9,2.66 8.79,2.78 8.58,2.9 8.37,3.02 8.16,3.14 7.96,3.27 7.75,3.4 7.55,3.53 7.35,3.67 7.16,3.81 6.97,3.95 6.77,4.09 6.58,4.24 6.21,4.55 6.03,4.7 5.85,4.87 5.68,5.03 5.5,5.19 5.16,5.53 5,5.71 4.84,5.88 4.68,6.06 4.52,6.24 4.37,6.43 4.21,6.61 4.06,6.8 3.92,6.99 3.78,7.19 3.64,7.38 3.5,7.58 3.37,7.78 3.24,7.99 3.11,8.19 2.99,8.4 2.87,8.61 2.75,8.82 2.64,9.03 2.52,9.25 2.42,9.47 2.31,9.68 2.21,9.91 2.12,10.13 2.02,10.36 1.93,10.58 1.85,10.81 1.77,11.04 1.69,11.27 1.61,11.51 1.54,11.74 1.47,11.98 1.41,12.22 1.35,12.46 1.3,12.7 1.25,12.95 1.2,13.19 1.15,13.44 1.11,13.69 1.08,13.93 1.04,14.18 1.02,14.44 0.99,14.69 0.97,14.94 0.96,15.2 0.95,15.45 0.94,15.71 0.94,16.23 0.95,16.49 0.96,16.74 0.97,17 0.99,17.25 1.02,17.5 1.04,17.76 1.08,18.01 1.11,18.25 1.15,18.5 1.2,18.75 1.25,18.99 1.3,19.24 1.35,19.48 1.41,19.72 1.47,19.96 1.54,20.2 1.61,20.43 1.69,20.67 1.77,20.9 1.85,21.13 1.93,21.36 2.02,21.58 2.12,21.81 2.21,22.03 2.31,22.25 2.42,22.47 2.52,22.69 2.64,22.91 2.75,23.12 2.87,23.33 2.99,23.54 3.11,23.75 3.24,23.95 3.37,24.16 3.5,24.36 3.64,24.56 3.78,24.75 3.92,24.94 4.06,25.14 4.21,25.33 4.37,25.51 4.52,25.7 4.68,25.88 4.84,26.06 5,26.23 5.16,26.41 5.33,26.58 5.5,26.75 5.68,26.91 5.85,27.07 6.03,27.23 6.21,27.39 6.4,27.54 6.58,27.7 6.77,27.85 6.97,27.99 7.16,28.13 7.35,28.27 7.55,28.41 7.75,28.54 7.96,28.67 8.16,28.8 8.37,28.92 8.58,29.04 8.79,29.16 9,29.27 9.22,29.38 9.44,29.49 9.66,29.6 9.88,29.7 10.33,29.89 10.55,29.98 10.78,30.06 11.01,30.14 11.24,30.22 11.48,30.3 11.71,30.37 11.95,30.44 12.19,30.5 12.43,30.56 12.67,30.61 12.92,30.66 13.16,30.71 13.41,30.76 13.66,30.8 13.9,30.83 14.15,30.87 14.41,30.89 14.66,30.92 14.91,30.94 15.17,30.95 15.42,30.96 15.68,30.97 16.2,30.97 16.46,30.96 16.97,30.94 17.22,30.92 17.47,30.89 17.73,30.87 17.98,30.83 18.22,30.8 18.47,30.76 18.72,30.71 18.96,30.66 19.21,30.61 19.45,30.56 19.69,30.5 19.93,30.44 20.17,30.37 20.4,30.3 20.64,30.22 20.87,30.14 21.1,30.06 21.33,29.98 21.55,29.89 21.78,29.79 22,29.7 22.23,29.6 22.44,29.49 22.66,29.38 22.88,29.27 23.09,29.16 23.3,29.04 23.51,28.92 23.72,28.8 23.92,28.67 24.13,28.54 24.53,28.27 24.72,28.13 24.92,27.99 25.11,27.85 25.3,27.7 25.48,27.54 25.67,27.39 25.85,27.23 26.03,27.07 26.2,26.91 26.38,26.75 26.55,26.58 26.72,26.41 26.88,26.23 27.04,26.06 27.2,25.88 27.36,25.7 27.51,25.51 27.67,25.33 27.82,25.14 27.96,24.94 28.1,24.75 28.24,24.56 28.38,24.36 28.51,24.16 28.64,23.95 28.77,23.75 28.89,23.54 29.01,23.33 29.13,23.12 29.25,22.91 29.36,22.69 29.46,22.47 29.57,22.25 29.67,22.03 29.76,21.81 29.86,21.58 29.95,21.36 30.03,21.13 30.11,20.9 30.19,20.67 30.27,20.43 30.34,20.2 30.41,19.96 30.47,19.72 30.53,19.48 30.59,19.24 30.69,18.75 30.73,18.5 30.77,18.25 30.81,18.01 30.84,17.76 30.89,17.25 30.91,17 30.92,16.74 30.93,16.49 30.94,16.23 30.94,15.71
N$43
  Bottom 0.4: 30.94,15.71 30.93,15.45 30.92,15.2 30.91,14.94 30.89,14.69 30.84,14.18 30.81,13.93 30.77,13.69 30.73,13.44 30.69,13.19 30.64,12.95 30.59,12.7 30.53,12.46 30.47,12.22 30.41,11.98 30.34,11.74 30.27,11.51 30.19,11.27 30.11,11.04 30.03,10.81 29.95,10.58 29.86,10.36 29.76,10.13 29.67,9.91 29.57,9.68 29.46,9.47 29.36,9.25 29.25,9.03 29.13,8.82 29.01,8.61 28.89,8.4 28.77,8.19 28.64,7.99 28.51,7.78 28.38,7.58 28.24,7.38 28.1,7.19 27.96,6.99 27.82,6.8 27.67,6.61 27.51,6.43 27.36,6.24 27.2,6.06 27.04,5.88 26.88,5.71 26.72,5.53 26.55,5.36 26.38,5.19 26.2,5.03 26.03,4.87 25.85,4.7 25.67,4.55 25.3,4.24 25.11,4.09 24.92,3.95 24.72,3.81 24.53,3.67 24.13,3.4 23.92,3.27 23.72,3.14 23.51,3.02 23.3,2.9 23.09,2.78 22.88,2.66 22.66,2.55 22.44,2.45 22.23,2.34 22,2.24 21.78,2.15 21.55,2.05 21.33,1.96 21.1,1.88 20.87,1.8 20.64,1.72 20.17,1.57 19.93,1.5 19.69,1.44 19.45,1.38 19.21,1.32 18.96,1.27 18.72,1.22 18.47,1.18 18.22,1.14 17.98,1.1 17.73,1.07 17.47,1.05 17.22,1.02 16.97,1 16.46,0.98 16.2,0.97 15.68,0.97 15.42,0.98 15.17,0.99 14.91,1 14.66,1.02 14.41,1.05 14.15,1.07 13.9,1.1 13.66,1.14 13.41,1.18 13.16,1.22 12.92,1.27 12.67,1.32 12.43,1.38 12.19,1.44 11.95,1.5 11.71,1.57 11.48,1.64 11.24,1.72 11.01,1.8 10.78,1.88 10.55,1.96 10.33,2.05 9.88,2.24 9.66,2.34 9.44,2.45 9.22,2.55 9,2.66 8.79,2.78 8.58,2.9 8.37,3.02 8.16,3.14 7.96,3.27 7.75,3.4 7.55,3.53 7.35,3.67 7.16,3.81 6.97,3.95 6.77,4.09 6.58,4.24 6.21,4.55 6.03,4.7 5.85,4.87 5.68,5.03 5.5,5.19 5.16,5.53 5,5.71 4.84,5.88 4.68,6.06 4.52,6.24 4.37,6.43 4.21,6.61 4.06,6.8 3.92,6.99 3.78,7.19 3.64,7.38 3.5,7.58 3.37,7.78 3.24,7.99 3.11,8.19 2.99,8.4 2.87,8.61 2.75,8.82 2.64,9.03 2.52,9.25 2.42,9.47 2.31,9.68 2.21,9.91 2.12,10.13 2.02,10.36 1.93,10.58 1.85,10.81 1.77,11.04 1.69,11.27 1.61,11.51 1.54,11.74 1.47,11.98 1.41,12.22 1.35,12.46 1.3,12.7 1.25,12.95 1.2,13.19 1.15,13.44 1.11,13.69 1.08,13.93 1.04,14.18 1.02,14.44 0.99,14.69 0.97,14.94 0.96,15.2 0.95,15.45 0.94,15.71 0.94,16.23 0.95,16.49 0.96,16.74 0.97,17 0.99,17.25 1.02,17.5 1.04,17.76 1.08,18.01 1.11,18.25 1.15,18.5 1.2,18.75 1.25,18.99 1.3,19.24 1.35,19.48 1.41,19.72 1.47,19.96 1.54,20.2 1.61,20.43 1.69,20.67 1.77,20.9 1.85,21.13 1.93,21.36 2.02,21.58 2.12,21.81 2.21,22.03 2.31,22.25 2.42,22.47 2.52,22.69 2.64,22.91 2.75,23.12 2.87,23.33 2.99,23.54 3.11,23.75 3.24,23.95 3.37,24.16 3.5,24.36 3.64,24.56 3.78,24.75 3.92,24.94 4.06,25.14 4.21,25.33 4.37,25.51 4.52,25.7 4.68,25.88 4.84,26.06 5,26.23 5.16,26.41 5.33,26.58 5.5,26.75 5.68,26.91 5.85,27.07 6.03,27.23 6.21,27.39 6.4,27.54 6.58,27.7 6.77,27.85 6.97,27.99 7.16,28.13 7.35,28.27 7.55,28.41 7.75,28.54 7.96,28.67 8.16,28.8 8.37,28.92 8.58,29.04 8.79,29.16 9,29.27 9.22,29.38 9.44,29.49 9.66,29.6 9.88,29.7 10.33,29.89 10.55,29.98 10.78,30.06 11.01,30.14 11.24,30.22 11.48,30.3 11.71,30.37 11.95,30.44 12.19,30.5 12.43,30.56 12.67,30.61 12.92,30.66 13.16,30.71 13.41,30.76 13.66,30.8 13.9,30.83 14.15,30.87 14.41,30.89 14.66,30.92 14.91,30.94 15.17,30.95 15.42,30.96 15.68,30.97 16.2,30.97 16.46,30.96 16.97,30.94 17.22,30.92 17.47,30.89 17.73,30.87 17.98,30.83 18.22,30.8 18.47,30.76 18.72,30.71 18.96,30.66 19.21,30.61 19.45,30.56 19.69,30.5 19.93,30.44 20.17,30.37 20.4,30.3 20.64,30.22 20.87,30.14 21.1,30.06 21.33,29.98 21.55,29.89 21.78,29.79 22,29.7 22.23,29.6 22.44,29.49 22.66,29.38 22.88,29.27 23.09,29.16 23.3,29.04 23.51,28.92 23.72,28.8 23.92,28.67 24.13,28.54 24.53,28.27 24.72,28.13 24.92,27.99 25.11,27.85 25.3,27.7 25.48,27.54 25.67,27.39 25.85,27.23 26.03,27.07 26.2,26.91 26.38,26.75 26.55,26.58 26.72,26.41 26.88,26.23 27.04,26.06 27.2,25.88 27.36,25.7 27.51,25.51 27.67,25.33 27.82,25.14 27.96,24.94 28.1,24.75 28.24,24.56 28.38,24.36 28.51,24.16 28.64,23.95 28.77,23.75 28.89,23.54 29.01,23.33 29.13,23.12 29.25,22.91 29.36,22.69 29.46,22.47 29.57,22.25 29.67,22.03 29.76,21.81 29.86,21.58 29.95,21.36 30.03,21.13 30.11,20.9 30.19,20.67 30.27,20.43 30.34,20.2 30.41,19.96 30.47,19.72 30.53,19.48 30.59,19.24 30.69,18.75 30.73,18.5 30.77,18.25 30.81,18.01 30.84,17.76 30.89,17.25 30.91,17 30.92,16.74 30.93,16.49 30.94,16.23 30.94,15.71
RA
  Top 0.254: R4.1 R2.1
  Top 0.406: JP1.2 R4.1
REFOUT  (via drill 0.25)
  Top 0.2: U1.8 v14.57,18.02
  Top 0.305: C3.1 13.82,16.88 R8.2 15,17.59 v14.57,18.02
  Top 0.4: C6.2 9.75,27.69 v9.75,27.17
  Bottom 0.2: v14.57,18.02 15.59,18.79 15.59,27.17 15.46,27.55 14.95,28.06 11.14,28.06 10.25,27.17 v9.75,27.17
RESET  (via drill 0.25)
  Top 0.2: v21.68,15.74 22.84,15.74 R24.2 25.02,15.91 D2.A 26.08,15.91 27.02,14.98 27.02,11.67 26.51,11.17 22.95,9.39 20.16,9.39 ICSP.5
  Bottom 0.2: v21.68,15.74 19.95,17.47 U4.29
RL
  Top 0.406: JP1.1 R5.2
SCK  (via drill 0.25)
  Top 0.2: v15.08,9.64 16.6,9.64 17.75,10.78 ICSP.3
  Bottom 0.2: U4.17 15.28,11.17 14.06,11.17 13.81,10.91 13.81,10.15 14.32,9.64 v15.08,9.64
SIGNAL_OUT  (via drill 0.25)
  Top 0.2: U1.10 15.59,19.21 15.59,18.79 16.48,17.9 18.13,17.9 18.38,17.64 18.38,15.74 18.11,15.47 R9.1 16.48,15.47 C1.1
  Top 0.4: v17.11,14.72 17.62,15.23 R9.1
  Bottom 0.4: U4.23 15.33,15.98 15.33,15.99 16.86,15.99 17.37,15.48 17.37,14.98 v17.11,14.72
V_BATT
  Top 0.406: D3.A 8.85,12.66 U2.3 9.24,12.27 9.24,12.31
VBUS  (via drill 0.25)  (3 unrouted)
  Top 0.406: U3.3 12.1,10.34 12.79,10.78 12.79,12.05 12.29,12.31 11.31,12.31 U3.1 11.27,12.27 11.02,12.56 v10.25,13.58 | 6.67,13.29 v6.95,13.58 5.56,13.58 D3.C | 9.75,8.59 9.75,8.75 10,8.5 v10,7.23
  Bottom 0.406: v10.25,13.58 v6.95,13.58 6.95,10.28 v10,7.23
XTAL1  (1 unrouted)
  Bottom 0.406: 23.79,11.93 25.24,11.93 25.49,11.67 25.49,10.74 R22.2 25.61,10.42 Y2.3
XTAL2  (1 unrouted)
  Bottom 0.406: Y2.1 24.73,8.56 24.73,9.13 24.49,9.38 R22.1 23.78,10.67

### Text on the board
tPlace: AUG2015 | Mantro
bPlace: AUG2015 | LA | RA | RL | Mantro